# Altium schematic sheet Input.SchDoc
size A4
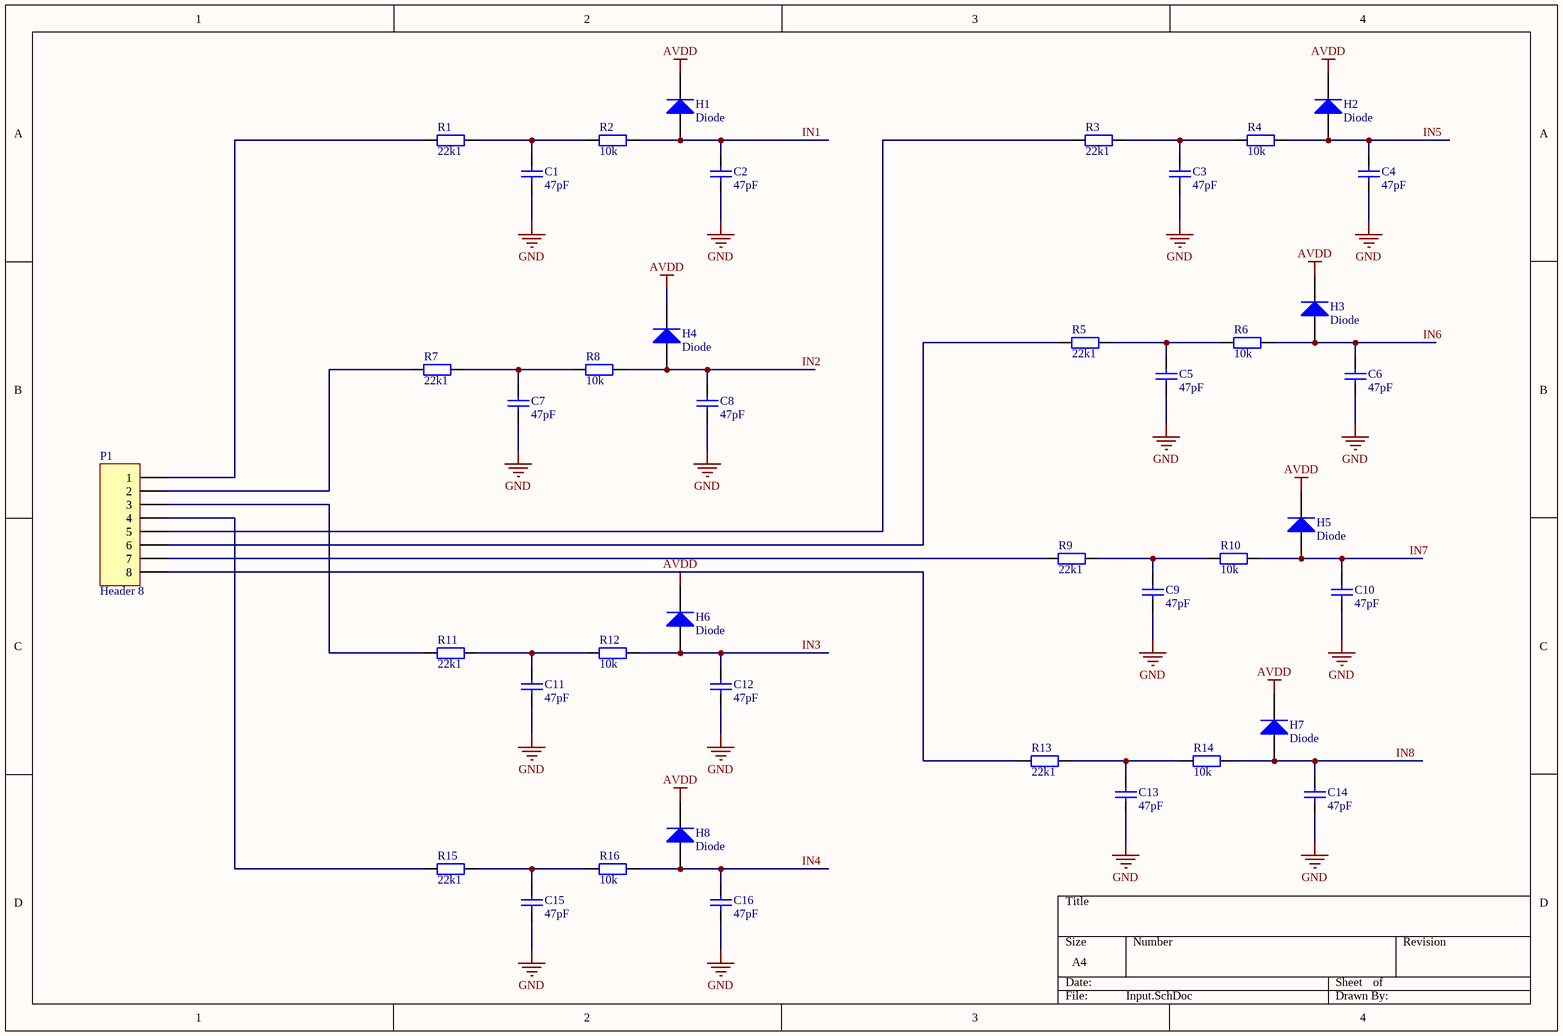
[diagram p0: Input.SchDoc]

## Parts
C1  47pF  [RAD-0.3]
C2  47pF  [RAD-0.3]
C3  47pF  [RAD-0.3]
C4  47pF  [RAD-0.3]
C5  47pF  [RAD-0.3]
C6  47pF  [RAD-0.3]
C7  47pF  [RAD-0.3]
C8  47pF  [RAD-0.3]
C9  47pF  [RAD-0.3]
C10  47pF  [RAD-0.3]
C11  47pF  [RAD-0.3]
C12  47pF  [RAD-0.3]
C13  47pF  [RAD-0.3]
C14  47pF  [RAD-0.3]
C15  47pF  [RAD-0.3]
C16  47pF  [RAD-0.3]
H1  Diode  [SMC]
H2  Diode  [SMC]
H3  Diode  [SMC]
H4  Diode  [SMC]
H5  Diode  [SMC]
H6  Diode  [SMC]
H7  Diode  [SMC]
H8  Diode  [SMC]
P1  Header 8  [HDR1X8]
R1  22k1  [AXIAL-0.4]
R2  10k  [AXIAL-0.4]
R3  22k1  [AXIAL-0.4]
R4  10k  [AXIAL-0.4]
R5  22k1  [AXIAL-0.4]
R6  10k  [AXIAL-0.4]
R7  22k1  [AXIAL-0.4]
R8  10k  [AXIAL-0.4]
R9  22k1  [AXIAL-0.4]
R10  10k  [AXIAL-0.4]
R11  22k1  [AXIAL-0.4]
R12  10k  [AXIAL-0.4]
R13  22k1  [AXIAL-0.4]
R14  10k  [AXIAL-0.4]
R15  22k1  [AXIAL-0.4]
R16  10k  [AXIAL-0.4]

## Nets
AVDD: H1.2(K) H2.2(K) H3.2(K) H4.2(K) H5.2(K) H6.2(K) H7.2(K) H8.2(K)
GND: C1.1 C2.1 C3.1 C4.1 C5.1 C6.1 C7.1 C8.1 C9.1 C10.1 C11.1 C12.1 C13.1 C14.1 C15.1 C16.1
IN1: C2.2 H1.1(A) R2.2
IN2: C8.2 H4.1(A) R8.2
IN3: C12.2 H6.1(A) R12.2
IN4: C16.2 H8.1(A) R16.2
IN5: C4.2 H2.1(A) R4.2
IN6: C6.2 H3.1(A) R6.2
IN7: C10.2 H5.1(A) R10.2
IN8: C14.2 H7.1(A) R14.2
NetC1_2: C1.2 R1.2 R2.1
NetC3_2: C3.2 R3.2 R4.1
NetC5_2: C5.2 R5.2 R6.1
NetC7_2: C7.2 R7.2 R8.1
NetC9_2: C9.2 R9.2 R10.1
NetC11_2: C11.2 R11.2 R12.1
NetC13_2: C13.2 R13.2 R14.1
NetC15_2: C15.2 R15.2 R16.1
NetP1_1: P1.1 R1.1
NetP1_2: P1.2 R7.1
NetP1_3: P1.3 R11.1
NetP1_4: P1.4 R15.1
NetP1_5: P1.5 R3.1
NetP1_6: P1.6 R5.1
NetP1_7: P1.7 R9.1
NetP1_8: P1.8 R13.1

## Library data of the parts
C1-C16 = Cap: Capacitor; Value: 100pF; Published: 8-Jun-2000; LatestRevisionDate: 17-Jul-2002; LatestRevisionNote: Re-released for DXP Platform.; PackageReference: RAD-0.3; Publisher: Altium Limited; PackageDescription: Radial Cap, Thru-Hole; 2 Leads; 0.3 in Pin Spacing
H1-H8 = Diode: Default Diode; Published: 8-Jun-2000; LatestRevisionDate: 17-Jul-2002; LatestRevisionNote: Re-released for DXP Platform.; PackageVersion: Sep-1996; PackageReference: SMC; Publisher: Altium Limited; PackageDescription: DO-214-AB/SMC; 2 C-Bend Leads; Body 7.9 x 5.9 mm, inc. leads (LxW); Code_JEDEC: DO-214-AB
P1 = Header 8: Header, 8-Pin; LatestRevisionDate: 17-Jul-2002; LatestRevisionNote: Re-released for DXP Platform.; Publisher: Altium Limited
R1-R16 = Res2: Resistor; Value: 1K; Published: 8-Jun-2000; LatestRevisionDate: 17-Jul-2002; LatestRevisionNote: Re-released for DXP Platform.; PackageReference: AXIAL-0.4; Publisher: Altium Limited; PackageDescription: Axial Device, Thru-Hole; 2 Leads; 0.4 in Pin Spacing